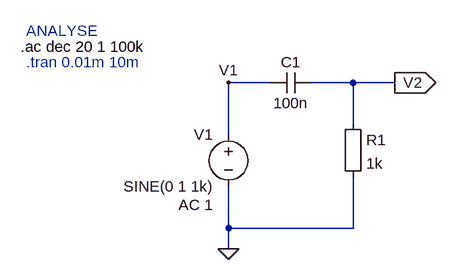
[diagram p0: schematic hw4p1.asc]
hw4p1.asc, the LTspice schematic file:
Version 4
SHEET 1 880 680
WIRE 160 144 96 144
WIRE 288 144 224 144
WIRE 352 144 288 144
WIRE 288 208 288 144
WIRE 96 224 96 144
WIRE 96 368 96 304
WIRE 288 368 288 288
WIRE 288 368 96 368
WIRE 96 400 96 368
FLAG 96 400 0
FLAG 352 144 V2
IOPIN 352 144 Out
FLAG 96 144 V1
SYMBOL cap 224 128 R90
WINDOW 0 0 32 VBottom 2
WINDOW 3 32 32 VTop 2
SYMATTR InstName C1
SYMATTR Value 100n
SYMBOL voltage 96 208 M0
WINDOW 123 24 124 Left 2
WINDOW 39 0 0 Left 0
SYMATTR Value2 AC 1
SYMATTR InstName V1
SYMATTR Value SINE(0 1 1k)
SYMBOL Misc/EuropeanResistor 272 192 R0
SYMATTR InstName R1
SYMATTR Value 1k
TEXT -224 88 Left 2 !.ac dec 20 1 100k
TEXT -216 64 Left 2 ;ANALYSE
TEXT -216 112 Left 2 ;.tran 0.01m 10m

The netlist it stands for:
* hw4p1.asc
C1 V2 V1 100n
V1 V1 0 SINE(0 1 1k) AC 1
R1 V2 0 1k
.ac dec 20 1 100k
* ANALYSE
* .tran 0.01m 10m
.backanno
.end